# EAGLE design ioboard (EAGLE 9.6.2)
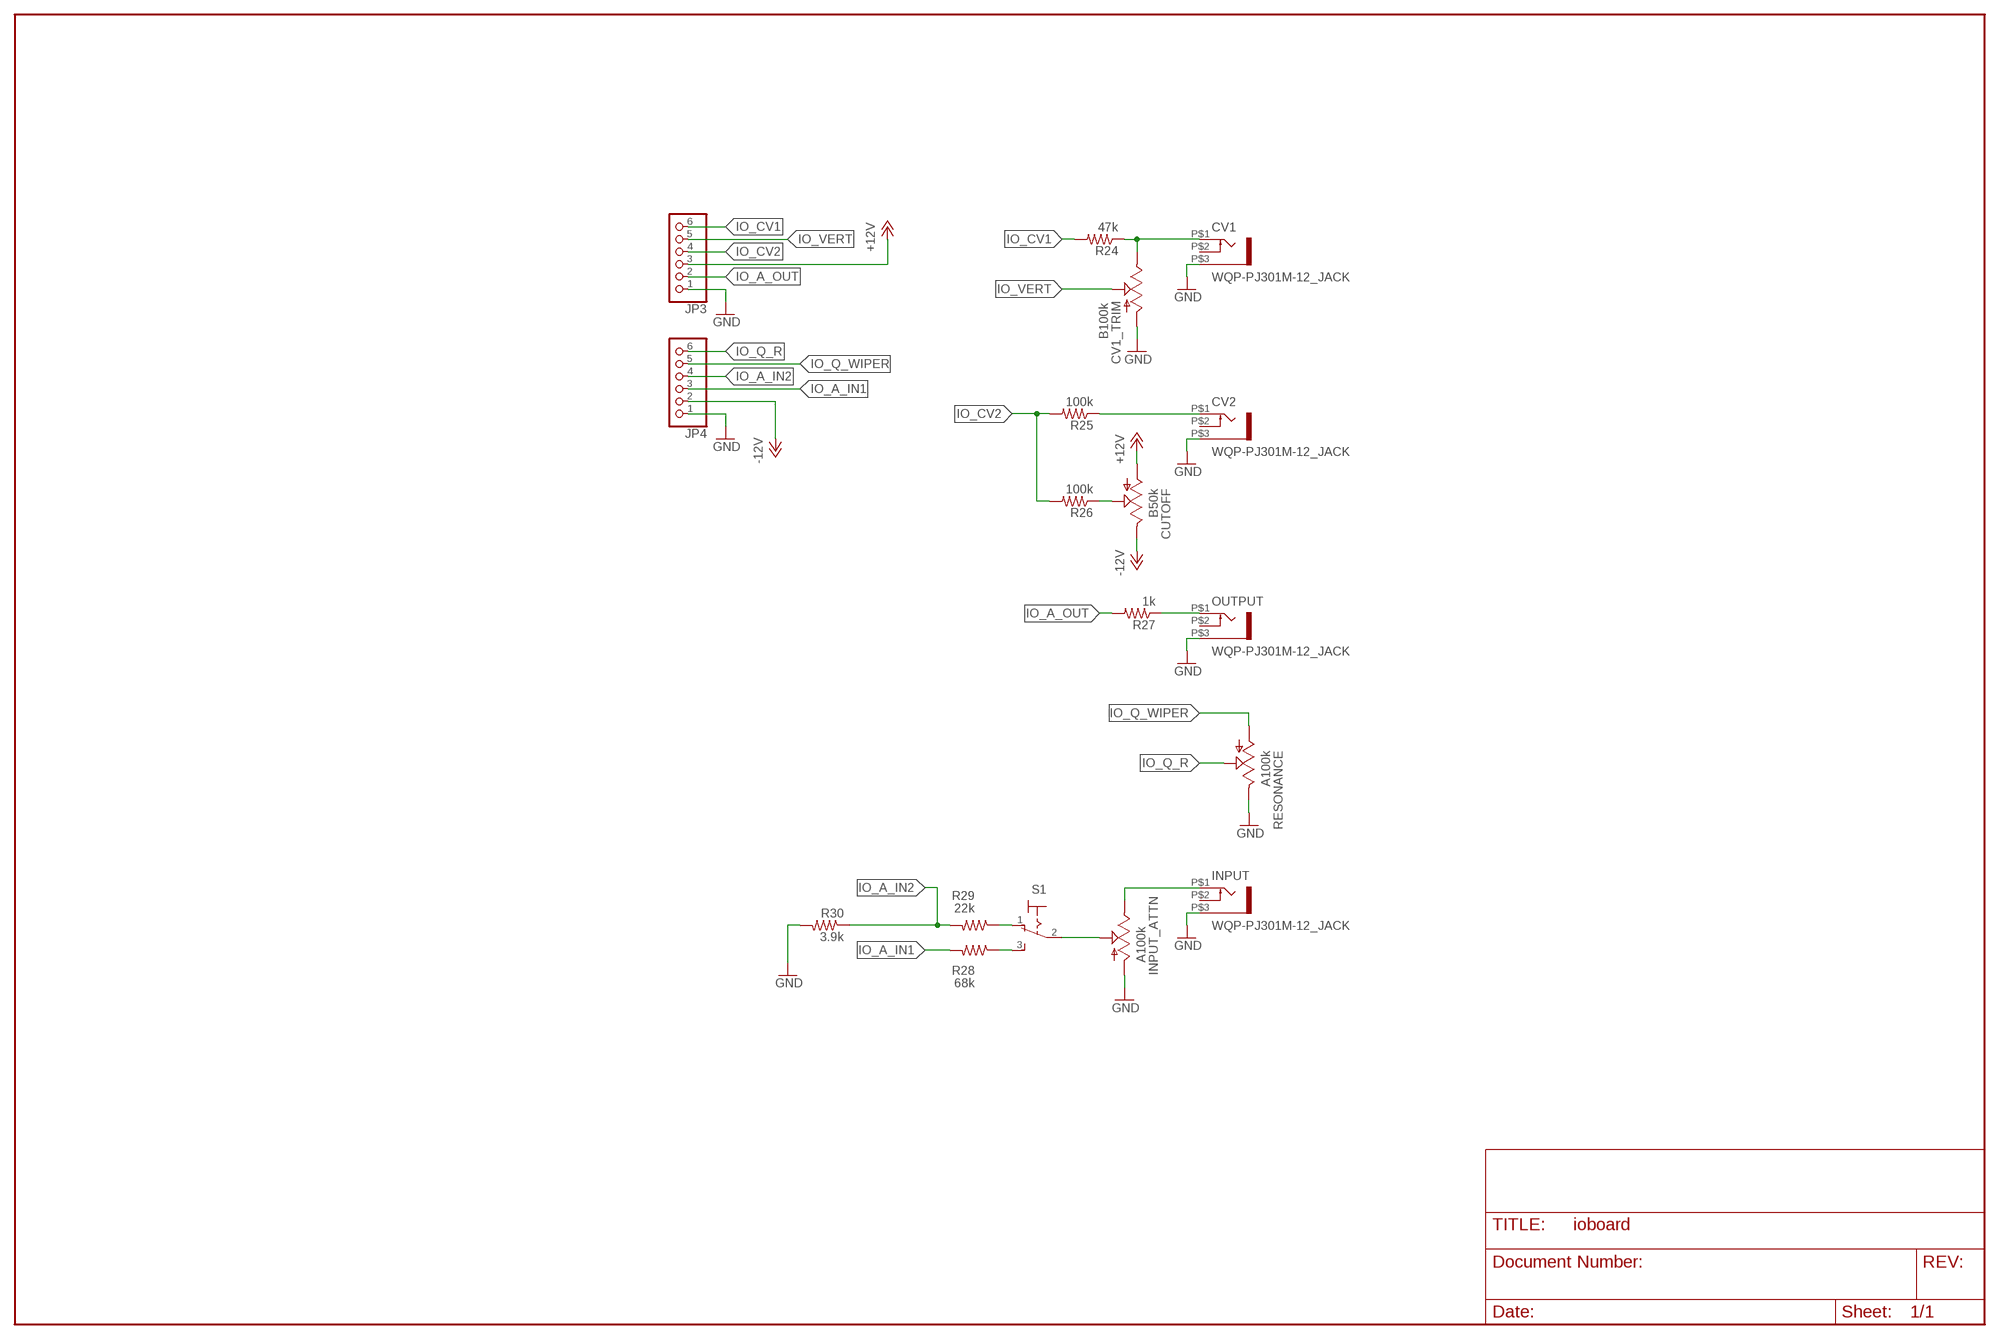
[diagram p0: schematic, sheet 1]

## Parts
CUTOFF  B50k  ALPHA-9MMA  [EVUF]
CV1  WQP-PJ301M-12_JACK  [WQP-PJ301M-12_JACK]
CV1_TRIM  B100k  ALPHA-9MMA  [EVUF]
CV2  WQP-PJ301M-12_JACK  [WQP-PJ301M-12_JACK]
INPUT  WQP-PJ301M-12_JACK  [WQP-PJ301M-12_JACK]
INPUT_ATTN  A100k  ALPHA-9MMA  [EVUF]
JP3  PINHD-1X6  [1X06]
JP4  PINHD-1X6  [1X06]
OUTPUT  WQP-PJ301M-12_JACK  [WQP-PJ301M-12_JACK]
R24  47k  R-US_0207/7  [0207/7]
R25  100k  R-US_0207/7  [0207/7]
R26  100k  R-US_0207/7  [0207/7]
R27  1k  R-US_0207/7  [0207/7]
R28  68k  R-US_0207/7  [0207/7]
R29  22k  R-US_0207/7  [0207/7]
R30  3.9k  R-US_0207/7  [0207/7]
RESONANCE  A100k  ALPHA-9MMA  [EVUF]
S1  M9040P  [M9040P]

## Nets
+12V: CUTOFF.1(A) JP3.3
-12V: CUTOFF.3(E) JP4.2
GND: CV1.P$3 CV1_TRIM.1(A) CV2.P$3 INPUT.P$3 INPUT_ATTN.1(A) JP3.1 JP4.1 OUTPUT.P$3 R30.2 RESONANCE.3(E)
IO_A_IN1: JP4.3 R28.2
IO_A_IN2: JP4.4 R29.2 R30.1
IO_A_OUT: JP3.2 R27.2
IO_CV1: JP3.6 R24.2
IO_CV2: JP3.4 R25.2 R26.2
IO_Q_R: JP4.6 RESONANCE.2(S)
IO_Q_WIPER: JP4.5 RESONANCE.1(A)
IO_VERT: CV1_TRIM.2(S) JP3.5
N$2: CV2.P$1 R25.1
N$5: INPUT_ATTN.2(S) S1.2(P)
N$6: CV1.P$1 CV1_TRIM.3(E) R24.1
N$27: OUTPUT.P$1 R27.1
N$30: CUTOFF.2(S) R26.1
N$36: R29.1 S1.1(O)
N$38: R28.1 S1.3(S)
N$42: INPUT.P$1 INPUT_ATTN.3(E)
Unconnected: CV1.P$2 CV2.P$2 INPUT.P$2 OUTPUT.P$2

## Library data of the parts
CUTOFF CV1_TRIM INPUT_ATTN RESONANCE = TomW:ALPHA-9MM: 9 mm Square Rotary Potentiometers Source: Panasonic
CV1 CV2 INPUT OUTPUT = thonkiconn:WQP-PJ301M-12_JACK
JP3 JP4 = pinhead:PINHD-1X6: PIN HEADER
R24-R30 = resistor:R-US_: RESISTOR, American symbol
S1 = switch:M9040P: TOGGLE SWITCH Marquardt

## Board
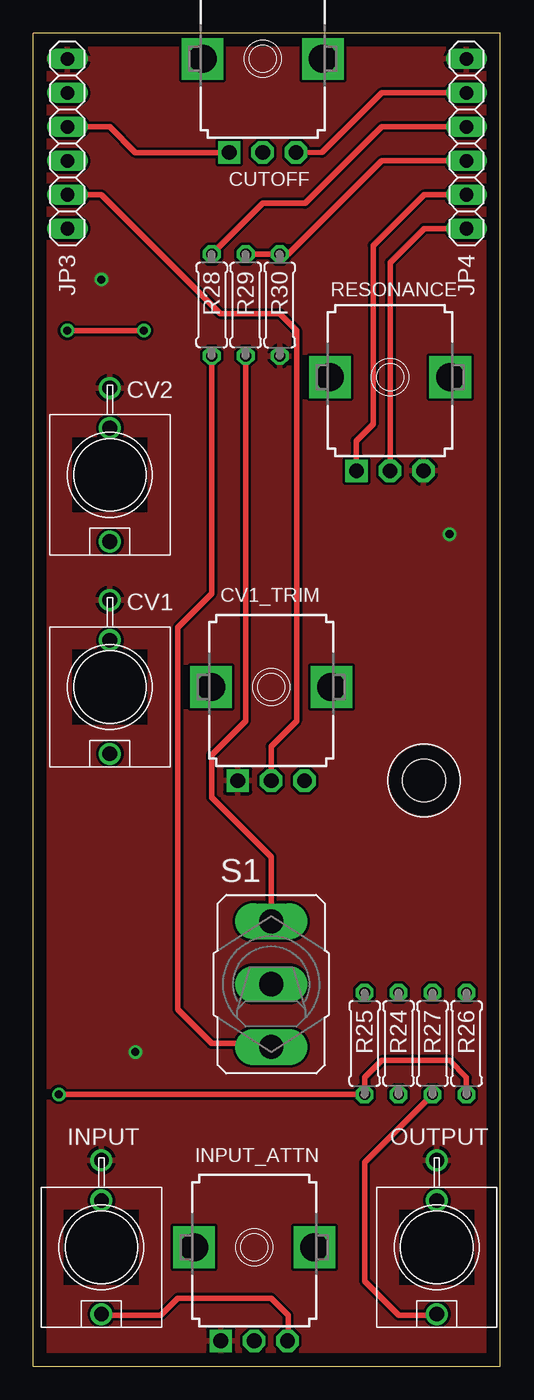
[diagram p1: board, top side]
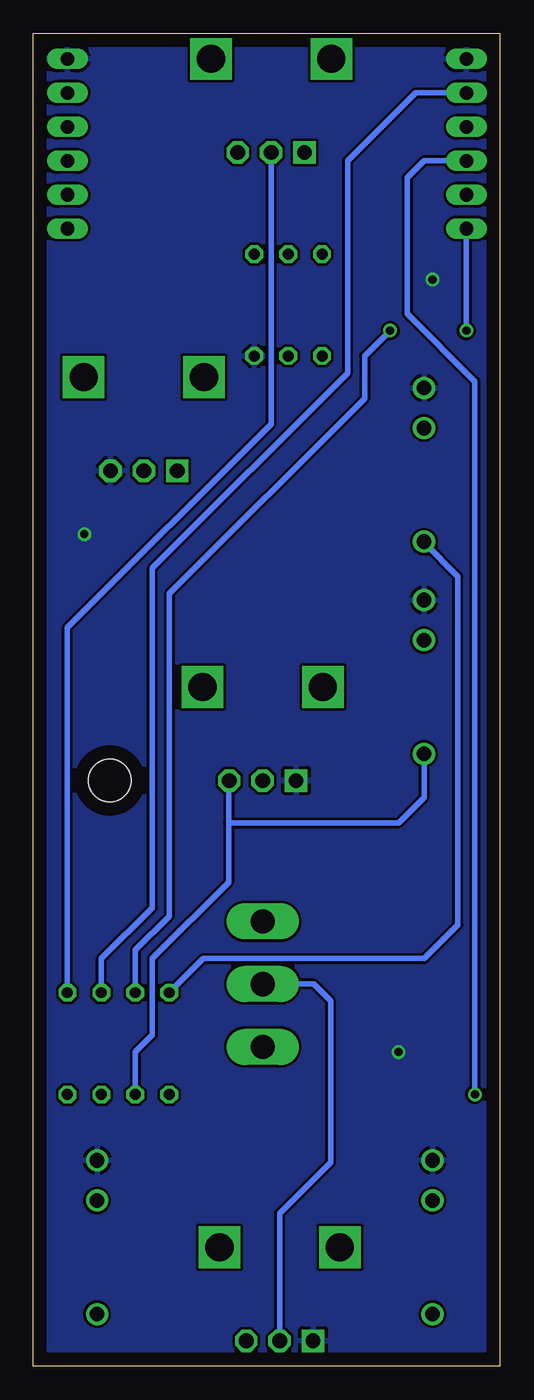
[diagram p2: board, bottom side, seen from below]

Size 34.92 x 99.69 mm. Coordinates in mm from the lower left corner, seen from the top.
Outline: 0,0 0,99.69 34.92,99.69 34.92,0 0,0
Copper layers (1*16): Top 0.035mm / dielectric 1.5mm / Bottom 0.035mm
Design rules "default": minimum track width 10mil, minimum drill 24mil, track to track 8mil, track to pad 8mil, pad to pad 8mil, via to via 8mil, smd to smd 8mil, copper to edge 40mil, drill to drill 8mil, minimum pad ring 10mil, minimum via ring 8mil, stop-mask expansion 4mil, vias tented up to drill 0mil, thermal gap 10mil
Holes 3.2 mm at 29.21,43.81

### Footprints (pad centres in the part's own frame; a part is rotated, then mirrored left to right if it is on the bottom)
EVUF = drill 1.1 pad 1.676 square: 1 -2.5,-7 | drill 1.1 pad 1.676 octagon: 2 0,-7; 3 2.5,-7 | drill 2.1 pad 2.8 square: M1 4.5,0; M2 -4.5,0
WQP-PJ301M-12_JACK = drill 1.1: P$1 0,5; P$2 0,-3.5; P$3 0,-6.5
1X06 = drill 1.016 long: 1 -6.35,0; 2 -3.81,0; 3 -1.27,0; 4 1.27,0; 5 3.81,0; 6 6.35,0
0207/7 = drill 0.813 octagon: 1 -3.81,0; 2 3.81,0
M9040P = drill 1.803 long: 1 0,4.699; 2 0,0; 3 0,-4.699

### Placement (x,y rotation side)
CUTOFF  17.14,97.79 0 top
CV1  5.71,50.8 180 top
CV1_TRIM  17.78,50.8 0 top
CV2  5.71,66.67 180 top
INPUT  5.08,8.89 180 top
INPUT_ATTN  16.51,8.89 0 top
JP3  2.54,91.44 270 top
JP4  32.38,91.44 270 top
OUTPUT  30.16,8.89 180 top
R24  27.3,24.13 90 top
R25  24.77,24.13 270 top
R26  32.38,24.13 270 top
R27  29.84,24.13 90 top
R28  13.34,79.38 90 top
R29  15.88,79.38 90 top
R30  18.41,79.38 270 top
RESONANCE  26.67,73.98 0 top
S1  17.78,28.57 0 top

### Tracks (layer width: path | path; a pad name or v marks a point on that pad's centre or on a via)
+12V
  Top 0.406: JP3.3 5.71,92.71 7.62,90.79 CUTOFF.1
-12V
  Top 0.406: JP4.2 26.04,95.25 21.59,90.81 CUTOFF.3
GND  (via drill 0.61)
  other vias: 31.11,62.23 5.08,81.28 7.62,23.5
  pour Bottom: 34.92,99.69 0,99.69 0,0 34.92,0
  pour Top: 34.92,99.69 0,99.69 0,0 34.92,0
IO_A_IN1
  Top 0.406: JP4.3 26.04,92.71 20.32,87 17.14,87 R28.2
IO_A_IN2
  Top 0.406: JP4.4 26.04,90.17 19.05,83.19 R30.1 R29.2
IO_A_OUT
  Bottom 0.406: JP3.2 6.35,95.25 11.43,90.17 11.43,74.3 26.04,59.69 26.04,34.29 29.84,30.48 R27.2
IO_CV1  (via drill 0.61)
  Top 0.406: v2.54,77.47 v8.26,77.47
  Bottom 0.406: JP3.6 v2.54,77.47 | v8.26,77.47 10.16,75.56 10.16,72.39 24.77,57.78 24.77,33.66 27.3,31.11 R24.2
IO_CV2  (via drill 0.61)
  Top 0.406: R26.2 32.38,21.59 31.11,22.86 26.04,22.86 24.77,21.59 R25.2 v1.91,20.32
  Bottom 0.406: JP3.4 5.71,90.17 6.99,88.9 6.99,78.74 1.91,73.66 v1.91,20.32
IO_Q_R
  Top 0.406: JP4.6 29.21,85.09 26.67,82.55 RESONANCE.2
IO_Q_WIPER
  Top 0.406: JP4.5 29.21,87.63 25.4,83.82 25.4,70.48 24.13,69.22 24.13,66.98 RESONANCE.1
IO_VERT
  Top 0.406: JP3.5 5.08,87.63 13.97,78.74 18.41,78.74 19.68,77.47 19.68,48.26 17.78,46.35 CV1_TRIM.2
N$2
  Bottom 0.406: R25.1 22.23,30.48 5.71,30.48 3.17,33.02 3.17,59.05 5.71,61.59 CV2.P$1
N$5
  Bottom 0.406: S1.2 13.97,28.57 12.7,27.3 12.7,15.24 16.51,11.43 INPUT_ATTN.2
N$6
  Bottom 0.406: 20.32,43.81 CV1_TRIM.3 arc60 20.32,43.81 | 20.32,40.64 arc-60 20.28,40.64 7.62,40.64 5.71,42.55 CV1.P$1 | 20.32,43.81 20.32,40.64 | R24.1 27.3,23.5 26.04,24.77 26.04,30.48 20.32,36.2 20.32,40.64
N$27
  Top 0.406: OUTPUT.P$1 29.84,3.81 27.3,3.81 24.77,6.35 24.77,15.24 R27.1
N$30
  Bottom 0.406: R26.1 32.38,55.24 17.14,70.48 CUTOFF.2
N$36
  Top 0.406: S1.1 17.78,38.1 13.34,42.55 13.34,45.72 15.88,48.26 R29.1
N$38
  Top 0.406: R28.1 13.34,57.78 10.79,55.24 10.79,26.67 13.34,24.13 17.78,24.13 arc-60 S1.3
N$42
  Top 0.406: INPUT_ATTN.3 19.01,1.91 19.05,2.54 19.05,3.81 17.78,5.08 10.79,5.08 9.53,3.81 5.08,3.81 INPUT.P$1